# EAGLE schematic displayNEU (EAGLE 9.5.1)
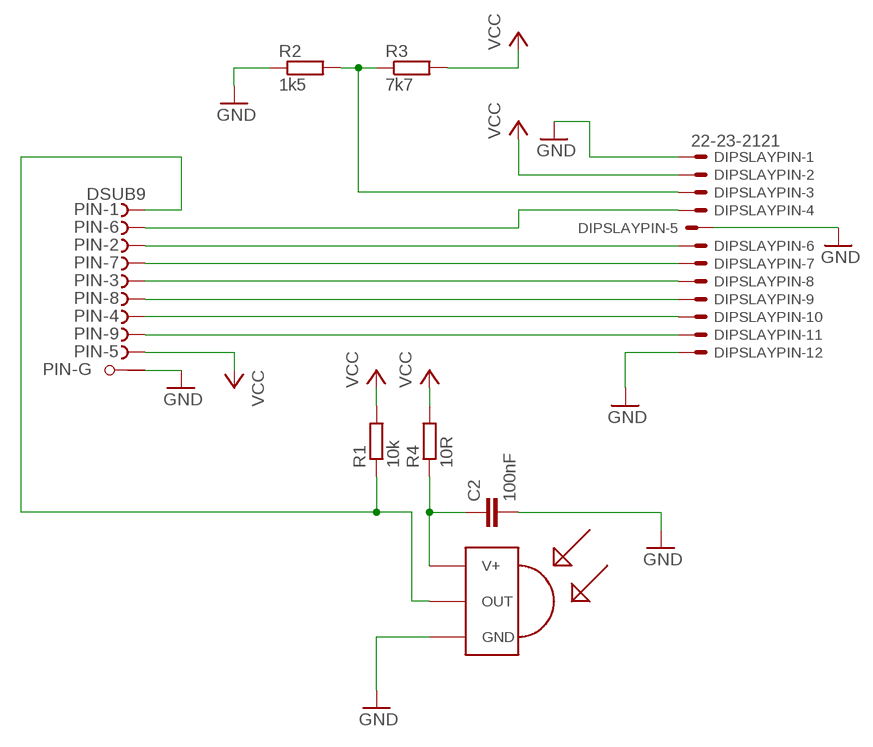
[diagram p0: schematic, sheet 1]

## Parts
C2  100nF  C-EU025-025X050  [C025-025X050]
DIPSLAYPIN  22-23-2121  [22-23-2121]
PIN  DSUB9  F09HPS  [F09HP]
R1  10k  R-EU_0207/10  [0207/10]
R2  1k5  R-EU_0207/10  [0207/10]
R3  7k7  R-EU_0207/10  [0207/10]
R4  10R  R-EU_0207/10  [0207/10]
U$1  TSOP4838  [TSOP18XX]

## Nets
GND: C2.2 DIPSLAYPIN.1 DIPSLAYPIN.5 DIPSLAYPIN.12 PIN.G1(-G:G1) R2.1 U$1.GND
N$1: DIPSLAYPIN.6 PIN.2(-2:F)
N$2: DIPSLAYPIN.7 PIN.7(-7:F)
N$3: DIPSLAYPIN.8 PIN.3(-3:F)
N$4: DIPSLAYPIN.9 PIN.8(-8:F)
N$5: DIPSLAYPIN.10 PIN.4(-4:F)
N$6: DIPSLAYPIN.11 PIN.9(-9:F)
N$7: PIN.1(-1:F) R1.1 U$1.OUT
N$8: DIPSLAYPIN.4 PIN.6(-6:F)
N$9: DIPSLAYPIN.3 R2.2 R3.1
N$10: C2.1 R4.1 U$1.VCC(V+)
VCC: DIPSLAYPIN.2 PIN.5(-5:F) R1.2 R3.2 R4.2
Unconnected: PIN.G2(-G:G2)

## Library data of the parts
C2 = rcl:C-EU: CAPACITOR, European symbol; SPICEPREFIX: C
DIPSLAYPIN = con-molex:22-23-2121: .100" (2.54mm) Center Header - 12 Pin; MF: MOLEX; MPN: 22-23-2121; OC_FARNELL: 1462935; OC_NEWARK: 56H0456
PIN = con-subd:F09HPS: SUB-D; OC_FARNELL: unknown; OC_NEWARK: unknown
R1-R4 = rcl:R-EU_: RESISTOR, European symbol; SPICEPREFIX: R
U$1 = tsop:TSOP4838: IR Receiver and Demodulator